# EAGLE design ogranicznik_napiecia (EAGLE 6.3)
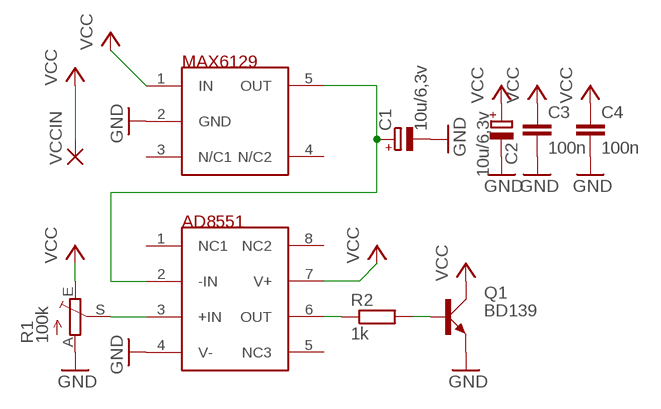
[diagram p0: schematic, sheet 1]

## Parts
C1  10u/6,3v  CPOL-EUSMCB  [SMC_B]
C2  10u/6,3v  CPOL-EUSMCB  [SMC_B]
C3  100n  C-EUC0805  [C0805]
C4  100n  C-EUC0805  [C0805]
Q1  BD139  [TO126AV]
R1  100k  TRIM_EU-RJ9W  [RJ9W]
R2  1k  R-EU_M0805  [M0805]
U$1  AD8551  [SOIC8]
U$2  MAX6129  [SOT23-5L]
VCCIN  2,54/0,9  [2,54/0,9]

## Nets
GND: C1.- C2.- C3.2 C4.2 Q1.E R1.A U$1.4(V-) U$2.2(GND)
N$1: Q1.B R2.2
N$2: R2.1 U$1.6(OUT)
N$3: R1.S U$1.3(+IN)
N$4: C1.+ U$1.2(-IN) U$2.5(OUT)
VCC: C2.+ C3.1 C4.1 Q1.C R1.E U$1.7(V+) U$2.1(IN) VCCIN.1(P)
Unconnected: U$1.1(NC1) U$1.5(NC3) U$1.8(NC2) U$2.3(N/C1) U$2.4(N/C2)

## Library data of the parts
C1 C2 = rcl:CPOL-EU: POLARIZED CAPACITOR, European symbol
C3 C4 = rcl:C-EU: CAPACITOR, European symbol
Q1 = transistor-power:BD139: NPN TRANSISTOR
R1 = pot:TRIM_EU-: POTENTIOMETER
R2 = rcl:R-EU_: RESISTOR, European symbol
U$1 = ref-packages:AD8551: Zero-Drift, Single-Supply, Rail-to-Rail Input/Output Operational Amplifiers
U$2 = ref-packages:MAX6129
VCCIN = wirepad:2,54/0,9: THROUGH-HOLE PAD

## Net classes
0 default: clearance 0.75 mm

## Board
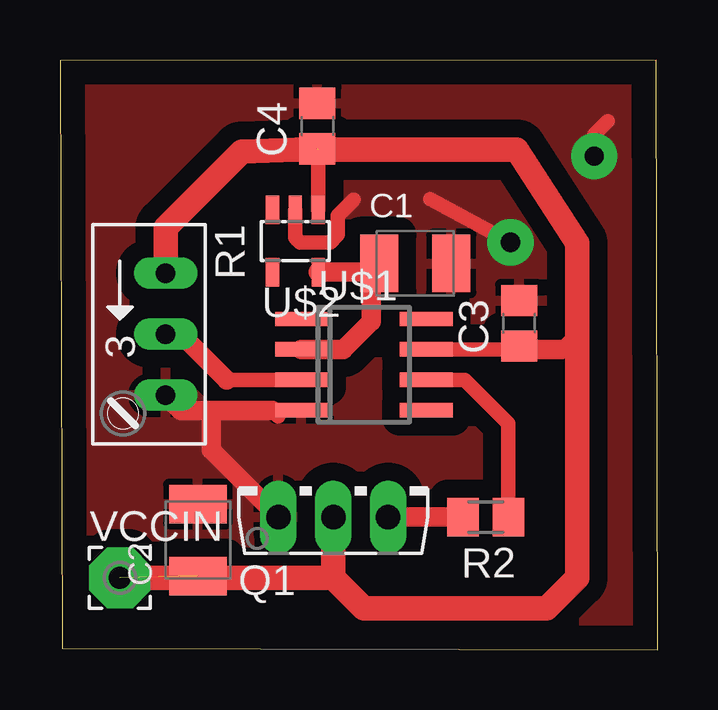
[diagram p1: board, top side]
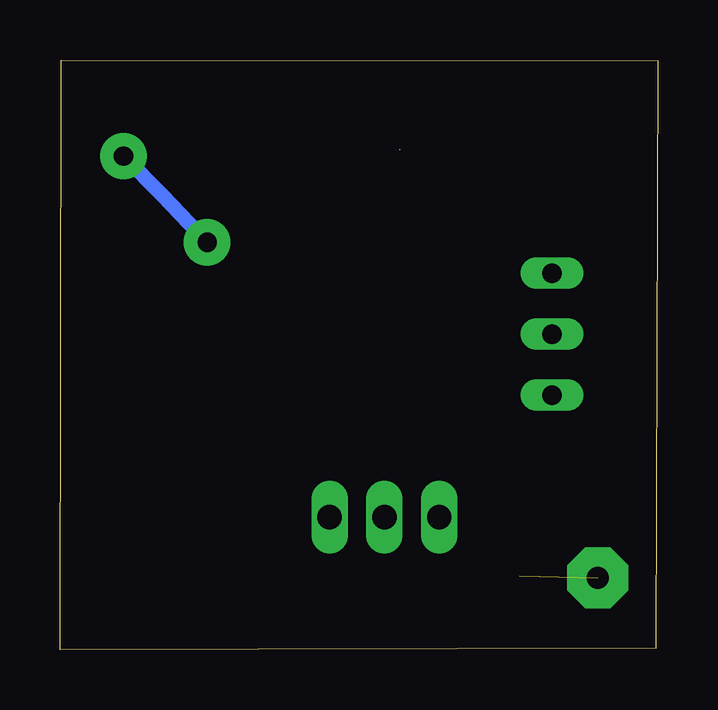
[diagram p2: board, bottom side, seen from below]

Size 24.91 x 24.6 mm. Coordinates in mm from the lower left corner, seen from the top.
Outline: 0.08,0.06 24.91,0 24.85,24.6 0,24.57 0.08,0.06
Copper layers (1*16): Top 0.035mm / dielectric 1.5mm / Bottom 0.035mm
Design rules "default": minimum track width 10mil, minimum drill 24mil, track to track 8mil, track to pad 8mil, pad to pad 8mil, via to via 8mil, smd to smd 8mil, copper to edge 40mil, drill to drill 8mil, minimum pad ring 10mil, minimum via ring 8mil, stop-mask expansion 4mil, vias tented up to drill 0mil, thermal gap 10mil

### Footprints (pad centres in the part's own frame; a part is rotated, then mirrored left to right if it is on the bottom)
SMC_B = smd 1.6 x 2.4: + -1.5,0; - 1.5,0
C0805 = smd 1.3 x 1.5: 1 -0.95,0; 2 0.95,0
TO126AV = drill 1.016 long: B 2.286,-1.27; C 0,-1.27; E -2.286,-1.27
RJ9W = drill 0.813 long: A 2.54,0.635; E -2.54,0.635; S 0,0.635
M0805 = smd 1.3 x 1.6: 1 -0.95,0; 2 0.95,0
SOIC8 = smd 0.6 x 2.2: 1 -1.905,-2.6; 2 -0.635,-2.6; 3 0.635,-2.6; 4 1.905,-2.6; 5 1.905,2.6; 6 0.635,2.6; 7 -0.635,2.6; 8 -1.905,2.6
SOT23-5L = smd 0.55 x 1.2: 1 -0.95,-1.3; 2 0,-1.3; 3 0.95,-1.3; 4 0.95,1.3; 5 -0.95,1.3
2,54/0,9 = drill 0.914 pad 2.54 octagon: 1 0,0

### Placement (x,y rotation side)
C1  14.8,16.11 0 top
C2  5.75,4.58 90 top
C3  19.13,13.62 90 top
C4  10.73,21.84 90 top
Q1  11.39,6.81 0 top
R1  3.77,13.16 270 top
R2  17.74,5.54 180 top
U$1  12.66,11.89 270 top
U$2  9.81,17.04 180 top
VCCIN  2.5,3 0 top

### Tracks (layer width: path | path; a pad name or v marks a point on that pad's centre or on a via)
GND  (via drill 0.8 pad 1.93)
  Top 0.61: U$1.4 8.85,9.99 9.1,9.73 | 15.43,18.79 v18.77,16.99 | v22.26,20.58 22.26,21.49 22.82,22.05 | U$2.2 9.81,17.2 10.02,16.99 11.25,16.99 11.58,17.31 11.58,18.11 12.24,18.77
  Top 0.813: 8.85,9.99 6.31,9.99 | 6.31,9.99 5.04,9.99 R1.A | Q1.E 6.31,8.33 6.31,9.99
  Bottom 0.61: v18.77,16.99 20.64,18.97 v22.26,20.58
  pour Top: -6.39,-3.35 34.25,-3.35 34.25,30.94 -6.39,30.94
N$1
  Top 0.813: Q1.B R2.2
N$2
  Top 0.61: U$1.6 16.87,11.26 18.68,9.44 R2.1
N$3
  Top 0.61: U$1.3 6.94,11.26 | 5.04,13.16 R1.S
  Top 0.813: 6.94,11.26 5.04,13.16
N$4
  Top 0.406: C1.+ 13.65,16.19 13.27,15.74 12.98,15.64
  Top 0.813: U$2.5 13.27,15.74 | U$1.2 11.81,12.53 12.98,13.7 12.98,15.64
VCC  (2 unrouted)
  Top 0.61: U$1.7 20.91,12.53 21.55,13.16 | U$2.1 10.76,18.79 10.76,20.86
  Top 0.813: 20.91,12.53 19.27,12.53 C3.1
  Top 1.016: R1.E 4.4,17.61 7.58,20.78 9.87,20.86 10.76,20.86 19.04,20.85 21.55,16.97 21.55,13.16 21.55,3 20.28,1.73 12.66,1.73 11.39,3 | VCCIN.1 11.39,3 | Q1.C 11.39,3